# Altium schematic sheet MCU.SchDoc
size 381 x 241 mm; SheetNumber: 5; SheetTotal: 12
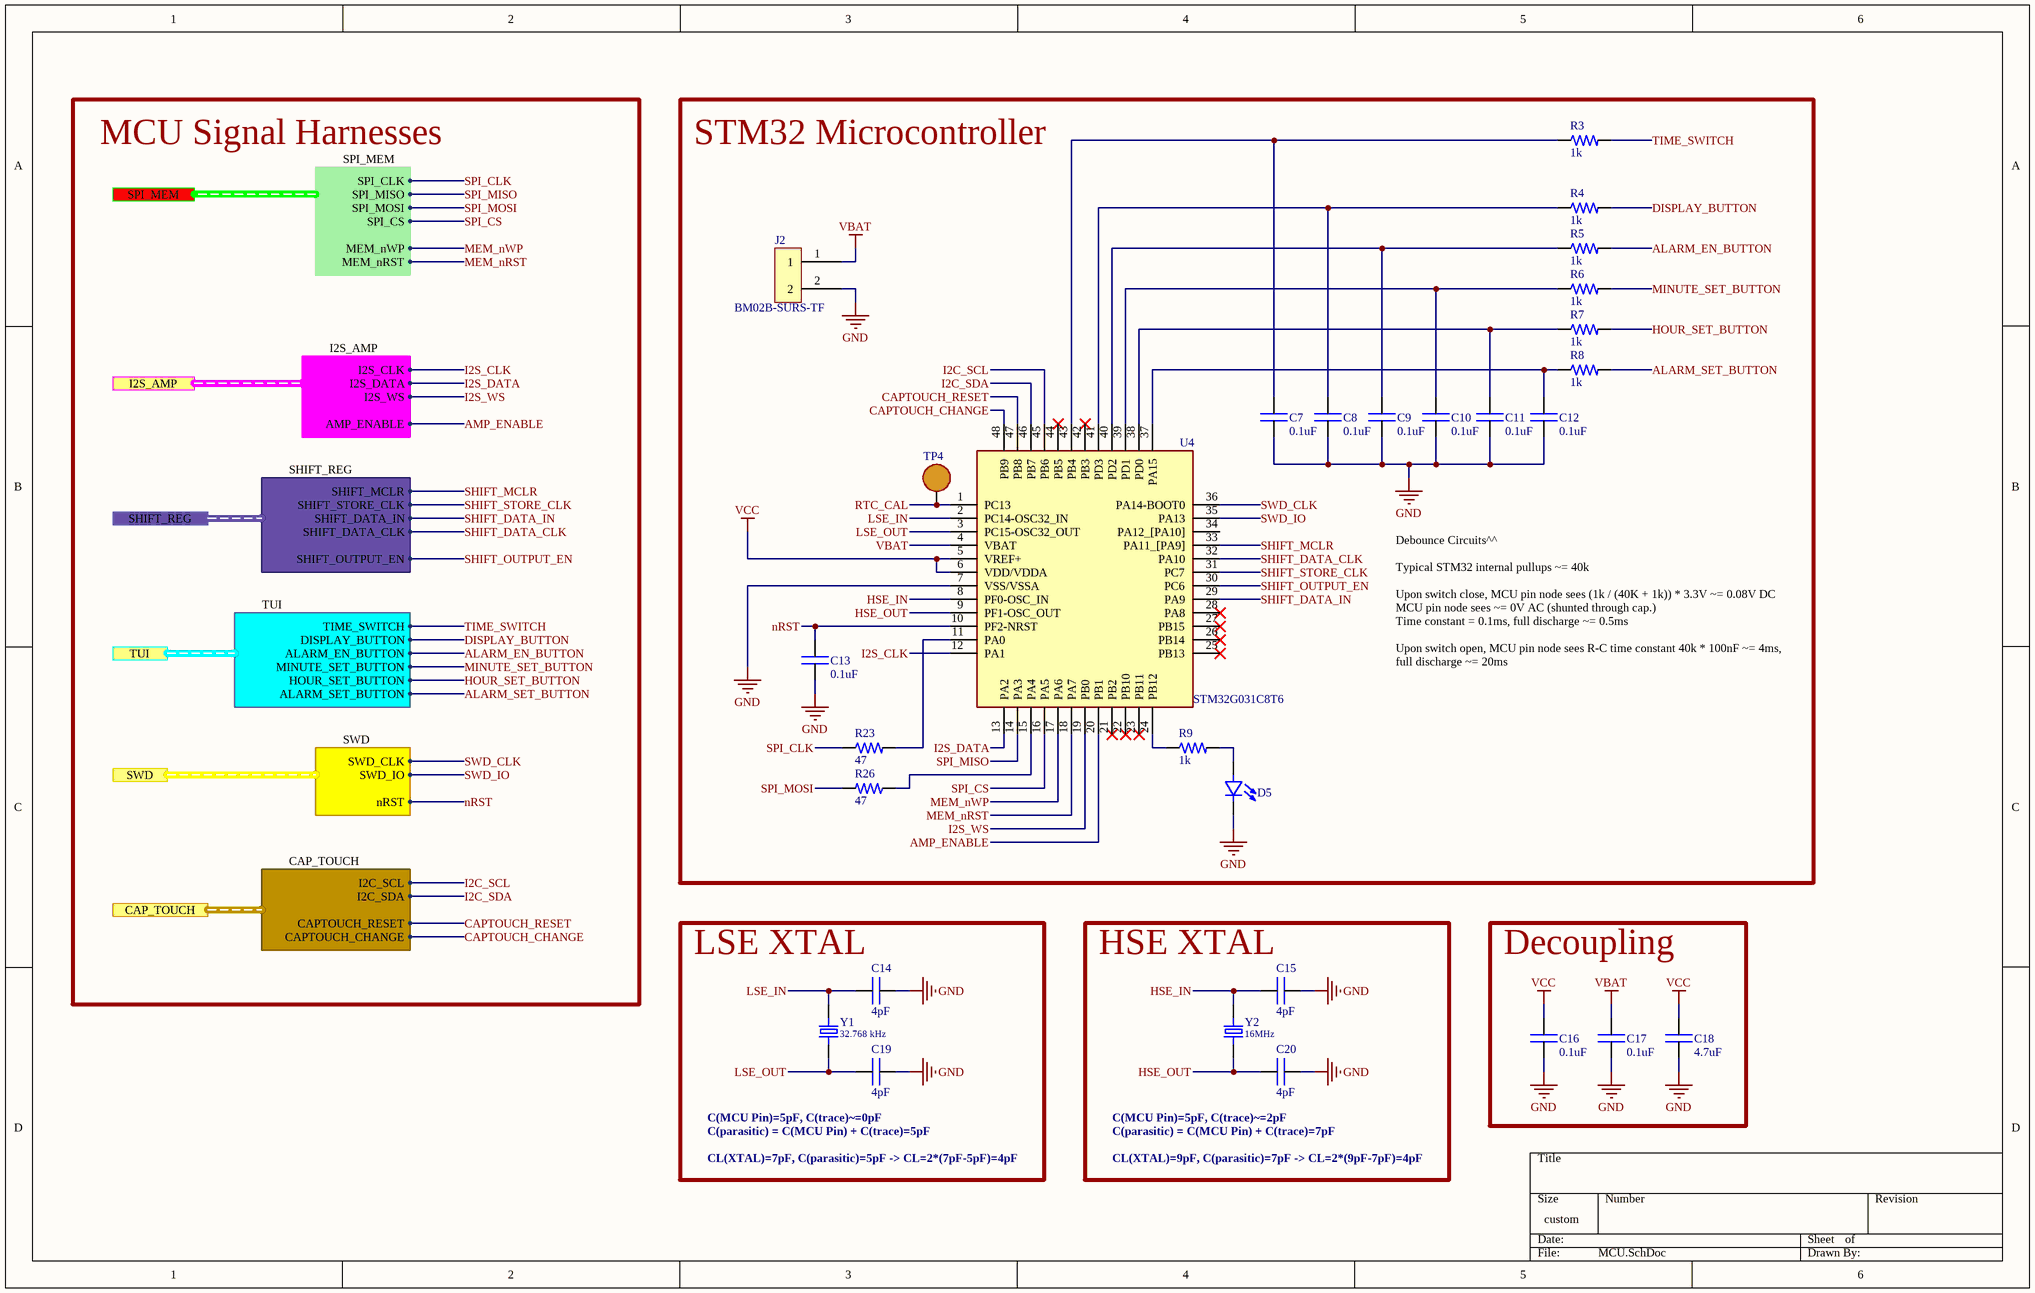
[diagram p0: MCU.SchDoc]

## Parts
C7  value 0.1uF  [0402C]  (hidden comment: CAP)
C8  value 0.1uF  [0402C]  (hidden comment: CAP)
C9  value 0.1uF  [0402C]  (hidden comment: CAP)
C10  value 0.1uF  [0402C]  (hidden comment: CAP)
C11  value 0.1uF  [0402C]  (hidden comment: CAP)
C12  value 0.1uF  [0402C]  (hidden comment: CAP)
C13  value 0.1uF  [0402C]  (hidden comment: CAP)
C14  value 4pF  [0402C]  (hidden comment: CAP)
C15  value 4pF  [0402C]  (hidden comment: CAP)
C16  value 0.1uF  [0402C]  (hidden comment: CAP)
C17  value 0.1uF  [0402C]  (hidden comment: CAP)
C18  value 4.7uF  [0402C]  (hidden comment: CAP)
C19  value 4pF  [0402C]  (hidden comment: CAP)
C20  value 4pF  [0402C]  (hidden comment: CAP)
D5  LED - single  [LED - 0603]  (value not drawn)
J2  BM02B-SURS-TF  [BM02B-SURS-TF]
R3  value 1k  [0402R]  (hidden comment: RES)
R4  value 1k  [0402R]  (hidden comment: RES)
R5  value 1k  [0402R]  (hidden comment: RES)
R6  value 1k  [0402R]  (hidden comment: RES)
R7  value 1k  [0402R]  (hidden comment: RES)
R8  value 1k  [0402R]  (hidden comment: RES)
R9  value 1k  [0402R]  (hidden comment: RES)
R23  value 47  [0402R]  (hidden comment: RES)
R26  value 47  [0402R]  (hidden comment: RES)
TP4  RCWCTE  [RCWCTE]  (value not drawn)
U4  STM32G031C8T6  [48-LQFP]
Y1  32.768 kHz  [ECS-.327-7-12R-TR]
Y2  16MHz  [4-SMD_NL]

## Blocks framed on the sheet
STM32 Microcontroller: C7-C13 D5 J2 R3-R9 R23 R26 TP4 U4
LSE XTAL: C14 C19 Y1
HSE XTAL: C15 C20 Y2
Decoupling: C16-C18

## Ports
CAP_TOUCH (harness CAP_TOUCH, see Brain-PCB_MASTER[3B], Cap-Touch[1B]), I2S_AMP (harness I2S_AMP, see Brain-PCB_MASTER[4B], Amplifier[1B]), SHIFT_REG (harness SHIFT_REG, see Brain-PCB_MASTER[4C], LED-PCB_Connector[2B]), SPI_MEM (harness SPI_MEM, see Brain-PCB_MASTER[3C], Isolation-Buffers[1B]), SWD (harness SWD, see Brain-PCB_MASTER[4C], SWD[2A]), TUI (harness TUI, see Brain-PCB_MASTER[3B], TUI[1B])

## Harnesses
SPI_MEM: SPI_CLK, SPI_MOSI, SPI_CS, SPI_MISO, MEM_nWP, MEM_nRST
I2S_AMP: I2S_CLK, I2S_DATA, I2S_WS, AMP_ENABLE
SHIFT_REG: SHIFT_MCLR, SHIFT_DATA_CLK, SHIFT_STORE_CLK, SHIFT_OUTPUT_EN, SHIFT_DATA_IN
TUI: TIME_SWITCH, DISPLAY_BUTTON, MINUTE_SET_BUTTON, ALARM_EN_BUTTON, HOUR_SET_BUTTON, ALARM_SET_BUTTON
SWD: nRST, SWD_CLK, SWD_IO
CAP_TOUCH: I2C_SCL, I2C_SDA, CAPTOUCH_RESET, CAPTOUCH_CHANGE

## Nets
GND: C7.1 C8.1 C9.1 C10.1 C11.1 C12.1 C13.1 C14.1 C15.1 C16.1 C17.1 C18.1 C19.1 C20.1 D5.2(C) J2.2 U4.7(VSS/VSSA)
VBAT: C17.2 J2.1 U4.4(VBAT)
VCC: C16.2 C18.2 U4.5(VREF+) U4.6(VDD/VDDA)
ALARM_EN_BUTTON: R5.2 ; port TUI.ALARM_EN_BUTTON
ALARM_SET_BUTTON: R8.2 ; port TUI.ALARM_SET_BUTTON
AMP_ENABLE: U4.20(PB1) ; port I2S_AMP.AMP_ENABLE
CAPTOUCH_CHANGE: U4.48(PB9) ; port CAP_TOUCH.CAPTOUCH_CHANGE
CAPTOUCH_RESET: U4.47(PB8) ; port CAP_TOUCH.CAPTOUCH_RESET
DISPLAY_BUTTON: R4.2 ; port TUI.DISPLAY_BUTTON
HOUR_SET_BUTTON: R7.2 ; port TUI.HOUR_SET_BUTTON
HSE_IN: C15.2 U4.8(PF0-OSC_IN) Y2.2
HSE_OUT: C20.2 U4.9(PF1-OSC_OUT) Y2.1
I2C_SCL: U4.45(PB6) ; port CAP_TOUCH.I2C_SCL
I2C_SDA: U4.46(PB7) ; port CAP_TOUCH.I2C_SDA
I2S_CLK: U4.12(PA1) ; port I2S_AMP.I2S_CLK
I2S_DATA: U4.13(PA2) ; port I2S_AMP.I2S_DATA
I2S_WS: U4.19(PB0) ; port I2S_AMP.I2S_WS
LSE_IN: C14.2 U4.2(PC14-OSC32_IN) Y1.2
LSE_OUT: C19.2 U4.3(PC15-OSC32_OUT) Y1.1
MEM_nRST: U4.18(PA7) ; port SPI_MEM.MEM_nRST
MEM_nWP: U4.17(PA6) ; port SPI_MEM.MEM_nWP
MINUTE_SET_BUTTON: R6.2 ; port TUI.MINUTE_SET_BUTTON
nRST: C13.2 U4.10(PF2-NRST) ; port SWD.nRST
RTC_CAL: TP4.1 U4.1(PC13)
SHIFT_DATA_CLK: U4.32(PA10) ; port SHIFT_REG.SHIFT_DATA_CLK
SHIFT_DATA_IN: U4.29(PA9) ; port SHIFT_REG.SHIFT_DATA_IN
SHIFT_MCLR: U4.33(PA11_[PA9]) ; port SHIFT_REG.SHIFT_MCLR
SHIFT_OUTPUT_EN: U4.30(PC6) ; port SHIFT_REG.SHIFT_OUTPUT_EN
SHIFT_STORE_CLK: U4.31(PC7) ; port SHIFT_REG.SHIFT_STORE_CLK
SPI_CLK: R23.1 ; port SPI_MEM.SPI_CLK
SPI_CS: U4.16(PA5) ; port SPI_MEM.SPI_CS
SPI_MISO: U4.14(PA3) ; port SPI_MEM.SPI_MISO
SPI_MOSI: R26.2 ; port SPI_MEM.SPI_MOSI
SWD_CLK: U4.36(PA14-BOOT0) ; port SWD.SWD_CLK
SWD_IO: U4.35(PA13) ; port SWD.SWD_IO
TIME_SWITCH: R3.2 ; port TUI.TIME_SWITCH
NetC7_2: C7.2 R3.1 U4.43(PB4)
NetC8_2: C8.2 R4.1 U4.41(PD3)
NetC9_2: C9.2 R5.1 U4.40(PD2)
NetC10_2: C10.2 R6.1 U4.39(PD1)
NetC11_2: C11.2 R7.1 U4.38(PD0)
NetC12_2: C12.2 R8.1 U4.37(PA15)
NetD5_1: D5.1(A) R9.2
NetR9_1: R9.1 U4.24(PB12)
NetR23_2: R23.2 U4.11(PA0)
NetR26_1: R26.1 U4.15(PA4)

Not connected (* = marked no-connect by the designer): U4 21(PB2)* 22(PB10)* 23(PB11)* 25(PB13)* 26(PB14)* 27(PB15)* 28(PA8)* 34(PA12_[PA10]) 42(PB3)* 44(PB5)*

## Notes on the sheet
- MCU Signal Harnesses
- Debounce Circuits^^
  Typical STM32 internal pullups ~= 40k
  Upon switch close, MCU pin node sees (1k / (40K + 1k)) * 3.3V ~= 0.08V DC
  MCU pin node sees ~= 0V AC (shunted through cap.)
  Time constant = 0.1ms, full discharge ~= 0.5ms
  Upon switch open, MCU pin node sees R-C time constant 40k * 100nF ~= 4ms, full discharge ~= 20ms
- CL(XTAL)=7pF, C(parasitic)=5pF -> CL=2*(7pF-5pF)=4pF
- (near C19) C(MCU Pin)=5pF, C(trace)~=0pF
- C(parasitic) = C(MCU Pin) + C(trace)=5pF
- CL(XTAL)=9pF, C(parasitic)=7pF -> CL=2*(9pF-7pF)=4pF
- (near C20) C(MCU Pin)=5pF, C(trace)~=2pF
- C(parasitic) = C(MCU Pin) + C(trace)=7pF

## Library data of the parts
C7-C13 C16 C17 = CAP: Capacitor; MFR: Murata Electronics; MFR PN: GRM155R71C104KA88J; Type: SMD; Vendor: *; Vendor PN: *; Vendor Link: *
C14 C15 C19 C20 = CAP: Capacitor; MFR: YAGEO; MFR PN: CC0402CRNPO9BN4R0; Type: SMD; Vendor: *; Vendor PN: *; Vendor Link: *
C18 = CAP: Capacitor; MFR: Murata Electronics; MFR PN: GRM155D81C475ME15J; Type: SMD; Vendor: *; Vendor PN: *; Vendor Link: *
D5 = LED - single: LED; MFR: Dialight; MFR PN: 5988070107F; Color: Green; Type: SMD
J2 = CONN 2POS 0.8MM PITCH: CONN HEADER SMD 2POS 0.8MM; MFR: JST; MFR PN: BM02B-SURS-TF; Type: SMD
R3-R9 = RES: Resistor; MFR PN: RC0402JR-071KL; MFR: YAGEO; Vendor: *; Vendor PN: *; Vendor Link: *; Type: SMD
R23 R26 = RES: Resistor; MFR PN: RC0402FR-0747RL; MFR: YAGEO; Vendor: *; Vendor PN: *; Vendor Link: *; Type: SMD
TP4 = TEST POINT: Test Point, Surface Mount; MFR: KOA Speer Electronics, Inc.; MFR PN: RCWCTE; Type: SMD
U4 = STM32G031C8T6: ARM® Cortex®-M0+ STM32G0 Microcontroller IC 32-Bit Single-Core 64MHz 64KB (64K x 8) FLASH 48-LQFP (7x7); MFR: STMicroelectronics; MFR PN: STM32G031C8T6; Type: SMD
Y1 = 32.768 kHz XTAL: SMD Tuning Fork Crystal; MFR: ECS Inc.; MFR PN: ECS-.327-7-12R-TR; Vendor: *; Vendor PN: *; Vendor Link: *; Type: SMD; Frequency: 32.768 kHz
Y2 = 16 MHz XTAL: CRYSTAL 16.0000MHZ 9PF SMD; MFR: EPSON; MFR PN: TSX-3225 16.0000MF09Z-AC0; Vendor: *; Vendor PN: *; Vendor Link: *; Type: SMD; Frequency: 16MHz